# Altium schematic sheet TLV521.SchDoc
size A
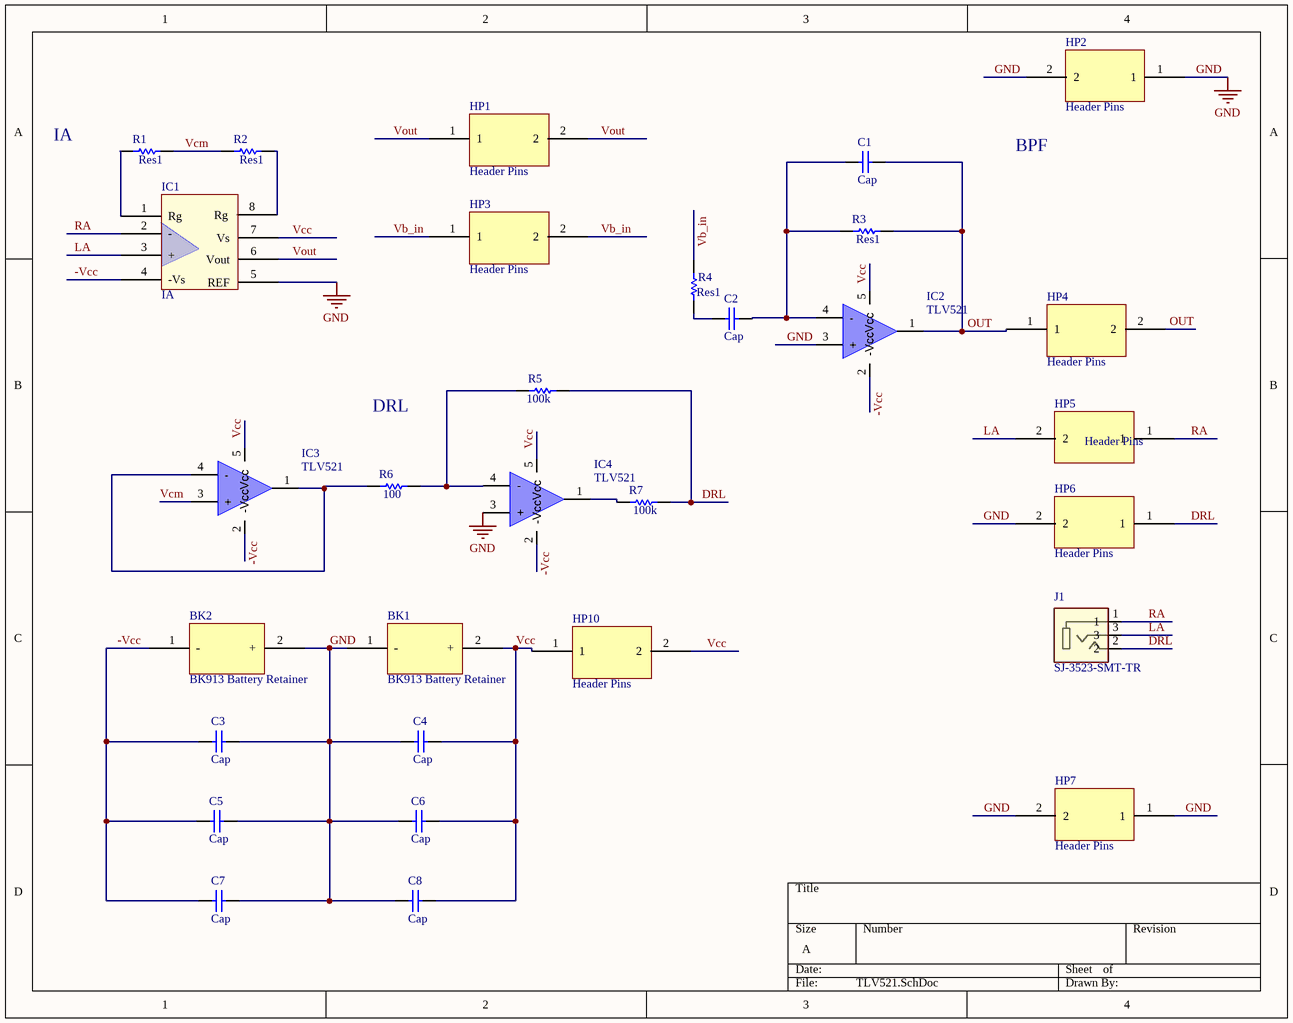
[diagram p0: TLV521.SchDoc]

## Parts
BK1  BK913 Battery Retainer  [BK913]
BK2  BK913 Battery Retainer  [BK913]
C1  Cap  [6-0805_M]
C2  Cap  [6-0805_M]
C3  Cap  [6-0805_M]
C4  Cap  [6-0805_M]
C5  Cap  [6-0805_M]
C6  Cap  [6-0805_M]
C7  Cap  [6-0805_M]
C8  Cap  [6-0805_M]
HP1  Header Pins  [Header_Pins]
HP2  Header Pins  [Header_Pins]
HP3  Header Pins  [Header_Pins]
HP4  Header Pins  [Header_Pins]
HP5  Header Pins  [Header_Pins]
HP6  Header Pins  [Header_Pins]
HP7  Header Pins  [Header_Pins]
HP10  Header Pins  [Header_Pins]
IC1  IA  [SOP2]
IC2  TLV521  [SOT65P210X110-5N]
IC3  TLV521  [SOT65P210X110-5N]
IC4  TLV521  [SOT65P210X110-5N]
J1  SJ-3523-SMT-TR  [*CUI_SJ-3523-SMT-TR]
R1  Res1  [6-0805_M]
R2  Res1  [6-0805_M]
R3  Res1  [6-0805_M]
R4  Res1  [6-0805_M]
R5  100k  [6-0805_M]
R6  100  [6-0805_M]
R7  100k  [6-0805_M]

## Nets
GND: BK1.1(-) BK2.2(+) C3.2 C4.1 C5.2 C6.1 C7.2 C8.1 HP2.1 HP2.2 HP6.2 HP7.1 HP7.2 IC1.5(REF) IC2.3(+) IC4.3(+)
-Vcc: BK2.1(-) C3.1 C5.1 C7.1 IC1.4(-Vs) IC2.2(-Vcc) IC3.2(-Vcc) IC4.2(-Vcc)
DRL: HP6.1 J1.2 R5.2 R7.2
LA: HP5.2 IC1.3(+) J1.3
OUT: C1.2 HP4.1 HP4.2 IC2.1(Vout) R3.2
RA: HP5.1 IC1.2(-) J1.1
Vb_in: HP3.1 HP3.2 R4.1
Vcc: BK1.2(+) C4.2 C6.2 C8.2 HP10.1 HP10.2 IC1.7(Vs) IC2.5(Vcc) IC3.5(Vcc) IC4.5(Vcc)
Vcm: IC3.3(+) R1.2 R2.1
Vout: HP1.1 HP1.2 IC1.6(Vout)
NetC1_1: C1.1 C2.2 IC2.4(-) R3.1
NetC2_1: C2.1 R4.2
NetIC1_1: IC1.1(Rg) R1.1
NetIC1_8: IC1.8(Rg) R2.2
NetIC3_1: IC3.1(Vout) IC3.4(-) R6.1
NetIC4_1: IC4.1(Vout) R7.1
NetIC4_4: IC4.4(-) R5.1 R6.2

## Notes on the sheet
- IA
- BPF
- DRL

## Library data of the parts
BK1 BK2 = BK-913: BATTERY RETAINER COIN PC PIN; Manufacturer 1: Memory Protection Devices; Number of Cells: 1; Supplier 1: Digi-Key; Supplier Part Number 1: BK-913-ND; Manufacturer Part Number 1: BK-913; Stock 1: 59379; Pricing 1: 1=0.42000, 10=0.35700, 100=0.29540, 500=0.25576, 1000=0.23935 (USD); RoHS: Yes; Mount: Through Hole,PCB; Package Quantity: 100; Termination: PC Pin; ComponentLink1URL: https://datasheet.ciiva.com/3/bk-913-datasheet-3800.pdf?src-supplier=Digi-Key; ComponentLink1Description: https://datasheet.ciiva.com/3/bk-913-datasheet-3800.pdf?src-supplier=Digi-Key; Category: Battery Products
C1-C8 = Cap: Capacitor; Value: 100pF; Published: 8-Jun-2000; LatestRevisionDate: 17-Jul-2002; LatestRevisionNote: Re-released for DXP Platform.; PackageReference: RAD-0.3; Publisher: Altium Limited; PackageDescription: Radial Cap, Thru-Hole; 2 Leads; 0.3 in Pin Spacing
IC1 = AD620ARZ-REEL7: IC OPAMP INSTR 1MHZ 8SOIC; Manufacturer 1: Analog Devices; Common Mode Rejection Ratio: 93dB; Number of Channels: 1; Min Supply Voltage: 4.6V; Min Dual Supply Voltage: 2.3V; Max Dual Supply Voltage: 18V; Slew Rate: 1.2V/µs; Nominal Supply Current: 900uA; Max Power Dissipation: 650mW; Bandwidth: 800kHz; Input Bias Current: 500pA; Input Offset Voltage (Vos): 30mV; Operating Supply Current: 1.3mA; Output Current per Channel: 18mA; Power Supply Rejection Ratio (PSRR): 140dB; Dual Supply Voltage: 15V; Input Resistance: 10GR; Supplier 1: Digi-Key; Supplier Part Number 1: AD620ARZ-REEL7CT-ND; Manufacturer Part Number 1: AD620ARZ-REEL7; Stock 1: 12581; Pricing 1: 1=9.81000, 10=8.85800, 25=8.44600, 100=7.33360, 250=7.00400 (USD); RoHS: Yes; Mount: Surface Mount; Case/Package: SOIC; Number of Pins: 8; Contact Plating: Tin,Matte; Min Operating Temperature: -55°C; Max Operating Temperature: 125°C; Packaging: Tape and Reel; Package Quantity: 1; -3db Bandwidth: 1MHz; Number of Circuits: 1; Number of Elements: 1; Power Dissipation: 650mW; Operating Supply Voltage: 18V; Radiation Hardening: No; Lead Free: Contains Lead; ComponentLink1URL: https://datasheet.ciiva.com/15128/getdatasheetpartid-88990-15128224.pdf?src-supplier=Verical; ComponentLink1Description: https://datasheet.ciiva.com/15128/getdatasheetpartid-88990-15128224.pdf?src-supplier=Verical; ComponentLink2URL: https://datasheet.ciiva.com/1579/26155-1579655.pdf?src-supplier=Newark; ComponentLink2Description: https://datasheet.ciiva.com/1579/26155-1579655.pdf?src-supplier=Newark; ComponentLink3URL: https://datasheet.ciiva.com/26847/ad620arz-reel7-26847213.pdf?src-supplier=IIIC; ComponentLink3Description: https://datasheet.ciiva.com/26847/ad620arz-reel7-26847213.pdf?src-supplier=IIIC; ComponentLink4URL: https://datasheet.ciiva.com/2976/ad620-2976391.pdf?src-supplier=Avnet; ComponentLink4Description: https://datasheet.ciiva.com/2976/ad620-2976391.pdf?src-supplier=Avnet; ComponentLink5URL: https://datasheet.ciiva.com/1794/ad620-1794712.pdf?src-supplier=Digi-Key; ComponentLink5Description: https://datasheet.ciiva.com/1794/ad620-1794712.pdf?src-supplier=Digi-Key; ComponentLink6URL: https://datasheet.ciiva.com/1794/ad620-1794713.pdf?src-supplier=Digi-Key; ComponentLink6Description: https://datasheet.ciiva.com/1794/ad620-1794713.pdf?src-supplier=Digi-Key; ComponentLink7URL: https://datasheet.ciiva.com/1794/ad620-1794714.pdf?src-supplier=Digi-Key; ComponentLink7Description: https://datasheet.ciiva.com/1794/ad620-1794714.pdf?src-supplier=Digi-Key; ComponentLink8URL: https://datasheet.ciiva.com/2975/ad620-2975599.pdf?src-supplier=Avnet; ComponentLink8Description: https://datasheet.ciiva.com/2975/ad620-2975599.pdf?src-supplier=Avnet; ComponentLink9URL: https://datasheet.ciiva.com/48709/001248702-da-01-en-ic-amp-inst-lp-ad620arz-reel7-soic-8-adi-48709622.pdf?src-supplier=Conrad; ComponentLink9Description: https://datasheet.ciiva.com/48709/001248702-da-01-en-ic-amp-inst-lp-ad620arz-reel7-soic-8-adi-48709622.pdf?src-supplier=Conrad; Category: Integrated Circuits (ICs)
IC2-IC4 = TLV521DCKT: IC OP AMP 6KHZ RR SC-70-5; Manufacturer 1: Texas Instruments; Number of Circuits: 1; Slew Rate: 2.5V/µs; Input Bias Current: 1pA; Input Offset Voltage (Vos): 100uV; Operating Supply Current: 350nA; Output Current per Channel: 12mA; Supplier 1: Digi-Key; Manufacturer Part Number 1: TLV521DCKT; Stock 1: 7572; Pricing 1: 1=0.64000, 10=0.54800, 100=0.40950 (USD); RoHS: Yes; Mount: Surface Mount; Case/Package: SC; Number of Pins: 5; Min Operating Temperature: -40°C; Max Operating Temperature: 125°C; Packaging: Cut Tape; Gain Bandwidth Product: 6kHz; Bandwidth: 6kHz; Number of Amplifiers: 1; Number of Channels: 1; REACH SVHC: No SVHC; Lead Free: Lead Free; ComponentLink1URL: http://www.ti.com/general/docs/lit/getliterature.tsp?genericPartNumber=TLV521&&fileType=pdf&src-supplier=Element14; ComponentLink1Description: http://www.ti.com/general/docs/lit/getliterature.tsp?genericPartNumber=TLV521&&fileType=pdf&src-supplier=Element14; ComponentLink2URL: http://www.ti.com/lit/pdf/slyt701?src-supplier=Digi-Key; ComponentLink2Description: http://www.ti.com/lit/pdf/slyt701?src-supplier=Digi-Key; ComponentLink3URL: http://www.ti.com/lit/ds/symlink/tlv521.pdf?src-supplier=Digi-Key; ComponentLink3Description: http://www.ti.com/lit/ds/symlink/tlv521.pdf?src-supplier=Digi-Key; ComponentLink4URL: http://www.ti.com/general/docs/lit/getliterature.tsp?genericPartNumber=TLV521&amp;&amp;fileType=pdf&src-supplier=Farnell; ComponentLink4Description: http://www.ti.com/general/docs/lit/getliterature.tsp?genericPartNumber=TLV521&amp;&amp;fileType=pdf&src-supplier=Farnell; Supplier Part Number 1: 296-44482-1-ND; Category: Integrated Circuits (ICs)
J1 = SJ-3523-SMT-TR: 3.5 mm, Stereo, Right Angle, Surface Mount _SMT_, Audio Jack Connector; MF: CUI Devices; CUI_purchase_URL: https://www.cuidevices.com/product/interconnect/connectors/audio-connectors/jacks/sj-352x-smt-series?utm_source=snapeda.com&utm_medium=referral&utm_campaign=snapedaBOM; Package: LGA-10 STMicroelectronics; Digi-Key_Purchase_URL: https://www.digikey.com/product-detail/en/cui-devices/SJ-3523-SMT-TR/CP-3523SJCT-ND/669704?utm_source=snapeda&utm_medium=aggregator&utm_campaign=symbol; Digi-Key_Part_Number: CP-3523SJCT-ND; SnapEDA_Link: https://www.snapeda.com/parts/SJ-3523-SMT-TR/CUI%20Devices/view-part/?ref=snap; MP: SJ-3523-SMT-TR; Value: *
R1-R7 = Res1: Resistor; Value: 1K; Published: 8-Jun-2000; LatestRevisionDate: 17-Jul-2002; LatestRevisionNote: Re-released for DXP Platform.; PackageReference: AXIAL-0.3; Publisher: Altium Limited; PackageDescription: Axial Device, Thru-Hole; 2 Leads; 0.3 in Pin Spacing